# Altium schematic sheet sim_868.SchDoc
size A4
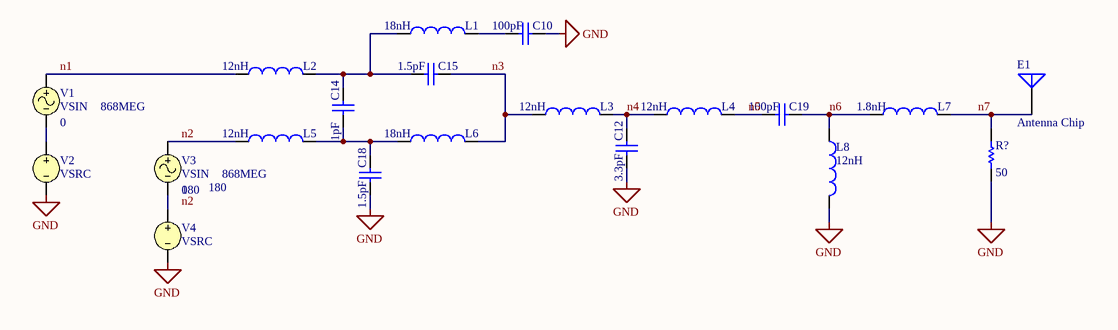
[diagram p0: sim_868.SchDoc]

## Parts
C10  value 100pF  [0402]  (hidden comment: Cap)
C12  value 3.3pF  [0402]  (hidden comment: Cap)
C14  value 1pF  [0402]  (hidden comment: Cap)
C15  value 1.5pF  [0402]  (hidden comment: Cap)
C18  value 1.5pF  [0402]  (hidden comment: Cap)
C19  value 100pF  [0402]  (hidden comment: Cap)
E1  Antenna Chip  [Johanson_0868AT43A0020]
L1  value 18nH  [0402-A]  (hidden comment: Inductor)
L2  value 12nH  [0402-A]  (hidden comment: Inductor)
L3  value 12nH  [0402-A]  (hidden comment: Inductor)
L4  value 12nH  [0402-A]  (hidden comment: Inductor)
L5  value 12nH  [0402-A]  (hidden comment: Inductor)
L6  value 18nH  [0402-A]  (hidden comment: Inductor)
L7  value 1.8nH  [0402-A]  (hidden comment: Inductor)
L8  value 12nH  [0402-A]  (hidden comment: Inductor)
R?  value 50  [AXIAL-0.3]  (hidden comment: Res1)
V1  VSIN  Offset: 0  Frequency: 868MEG
V2  VSRC
V3  VSIN  Offset: 0  Frequency: 868MEG  AC Phase: 180
V4  VSRC

## Nets
GND: C10.1 C12.1 C18.1 L8.2 R?.1 V2.2 V4.2
n1: L2.1 V1.1
n2: L5.1 V3.1
n3: C15.1 L3.1 L6.2
n4: C12.2 L3.2 L4.1
n5: C19.2 L4.2
n6: C19.1 L7.1 L8.1
n7: E1.1(A) L7.2 R?.2
NetC10_2: C10.2 L1.2
NetC14_1: C14.1 C18.2 L5.2 L6.1
NetC14_2: C14.2 C15.2 L1.1 L2.2
NetV1_2: V1.2 V2.1
NetV3_2: V3.2 V4.1

## Notes on the sheet
- Labels drawn without touching a wire or pin: n2

## Library data of the parts
C10 C19 = Cap: Capacitor; Manufacturer: FARNELL; RS: 806-8495; Order N: 2426878; Published: 8-Jun-2000; LatestRevisionDate: 17-Jul-2002; LatestRevisionNote: Re-released for DXP Platform.; PackageReference: RAD-0.3; Publisher: Altium Limited; PackageDescription: Radial Cap, Thru-Hole; 2 Leads; 0.3 in Pin Spacing; FARNELL: 2426878
C12 = Cap: Capacitor; Manufacturer: FARNELL; RS: 751-2049; Order N: 2210780; Published: 8-Jun-2000; LatestRevisionDate: 17-Jul-2002; LatestRevisionNote: Re-released for DXP Platform.; PackageReference: RAD-0.3; Publisher: Altium Limited; PackageDescription: Radial Cap, Thru-Hole; 2 Leads; 0.3 in Pin Spacing; FARNELL: 2210780
C14 = Cap: Capacitor; Manufacturer: FARNELL; RS: 788-0279; Order N: 1611944; Published: 8-Jun-2000; LatestRevisionDate: 17-Jul-2002; LatestRevisionNote: Re-released for DXP Platform.; PackageReference: RAD-0.3; Publisher: Altium Limited; PackageDescription: Radial Cap, Thru-Hole; 2 Leads; 0.3 in Pin Spacing; FARNELL: 1611944
C15 C18 = Cap: Capacitor; Manufacturer: FARNELL; RS: 788-0276; Order N: 1828869; Published: 8-Jun-2000; LatestRevisionDate: 17-Jul-2002; LatestRevisionNote: Re-released for DXP Platform.; PackageReference: RAD-0.3; Publisher: Altium Limited; PackageDescription: Radial Cap, Thru-Hole; 2 Leads; 0.3 in Pin Spacing; FARNELL: 1828869
E1 = Antenna: Generic Antenna; Manufacturer: FARNELL; RS: N.E.; PN: 0868AT43A0020E; Order N: 1885493; Published: 24-Mar-1999; LatestRevisionDate: 17-Jul-2002; LatestRevisionNote: Re-released for DXP Platform.; PackageReference: PIN1; Publisher: Altium Limited; FARNELL: 1885493
L1 L6 = Inductor: Manufacturer: FARNELL; Code_IEC: 1005; RS: 777-7022; Order N: 2103101; Published: 8-Jun-2000; LatestRevisionDate: 29-May-2009; LatestRevisionNote: IPC-7351 Footprint Added.; PackageReference: 0402-A; Publisher: Altium Limited; PackageDescription: Chip Inductor; Code_JEITA: 0402; FARNELL: 2103101
L2-L5 L8 = Inductor: Manufacturer: FARNELL; Code_IEC: 1005; RS: 701-6910; Order N: 2103098; Published: 8-Jun-2000; LatestRevisionDate: 29-May-2009; LatestRevisionNote: IPC-7351 Footprint Added.; PackageReference: 0402-A; Publisher: Altium Limited; PackageDescription: Chip Inductor; Code_JEITA: 0402; FARNELL: 2103098
L7 = Inductor: Manufacturer: FARNELL; Code_IEC: 1005; RS: 701-6807; Order N: 1669627; Published: 8-Jun-2000; LatestRevisionDate: 29-May-2009; LatestRevisionNote: IPC-7351 Footprint Added.; PackageReference: 0402-A; Publisher: Altium Limited; PackageDescription: Chip Inductor; Code_JEITA: 0402; FARNELL: 1669627
R? = Res1: Resistor; Published: 8-Jun-2000; LatestRevisionDate: 17-Jul-2002; LatestRevisionNote: Re-released for DXP Platform.; PackageReference: AXIAL-0.3; Publisher: Altium Limited; PackageDescription: Axial Device, Thru-Hole; 2 Leads; 0.3 in Pin Spacing
V1 V3 = VSIN: Sinusoidal Voltage Source; Note: PCB Footprint - Not required; Published: 8-Jun-2000; LatestRevisionDate: 15-Nov-2004; LatestRevisionNote: Corrected Netlist.; PackageReference: Not Applicable; Publisher: Altium Limited
  V3: Phase: 180
V2 V4 = VSRC: Voltage Source; Note: PCB Footprint - Not required; Value: 1; Published: 8-Jun-2000; LatestRevisionDate: 17-Jul-2002; LatestRevisionNote: Re-released for DXP Platform.; PackageReference: Not Applicable; Publisher: Altium Limited